# Altium schematic sheet USB_SWITCH.SchDoc
size A3; SheetNumber: 13; SheetTotal: 23
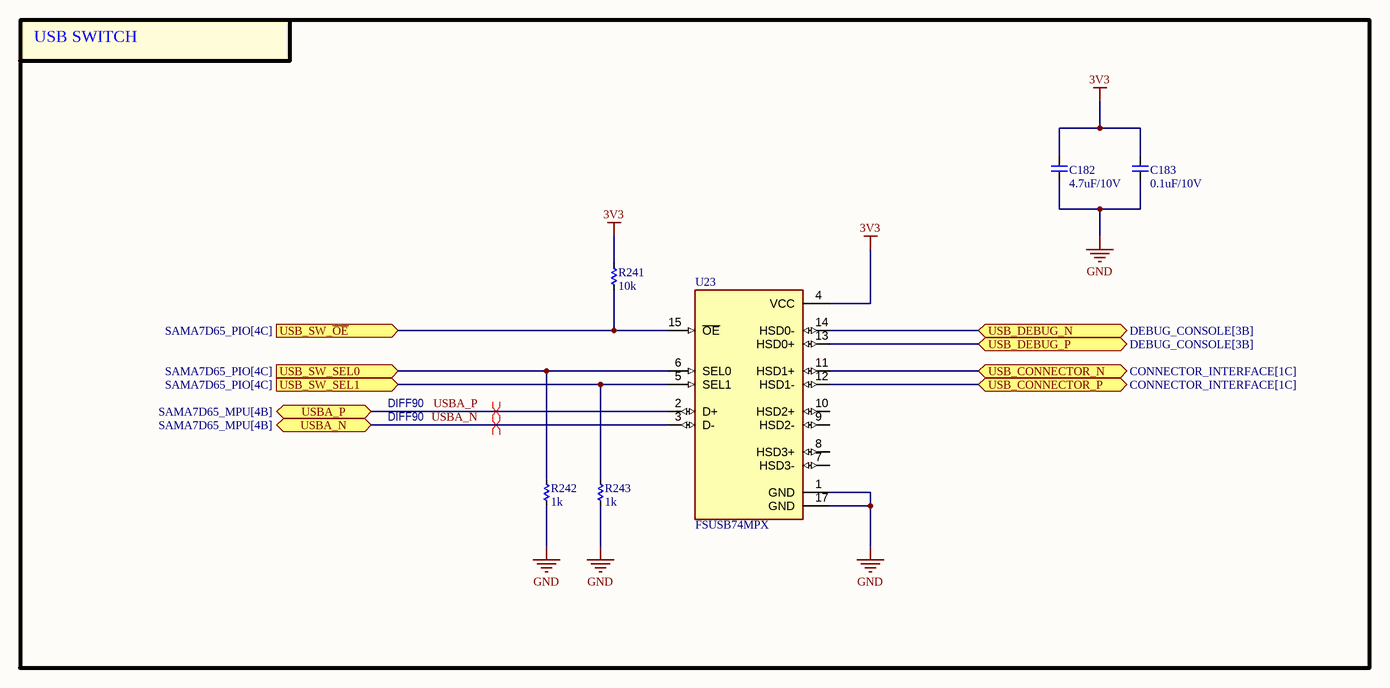
[diagram p0: USB_SWITCH.SchDoc]

## Parts
C182  4.7uF/10V  [CAP_C_1005X50_L]
C183  0.1uF/10V  [CAP_C_1005X50_L]
R241  10k  [RES_C_1005X40]
R242  1k  [RES_C_1005X40]
R243  1k  [RES_C_1005X40]
U23  FSUSB74MPX  [QFN50P300X300X80-17N]

## Blocks framed on the sheet
USB SWITCH: C182 C183 R241-R243 U23

## Ports
USB_CONNECTOR_N (bidir, see CONNECTOR_INTERFACE[1C]), USB_CONNECTOR_P (bidir, see CONNECTOR_INTERFACE[1C]), USB_DEBUG_N (bidir, see DEBUG_CONSOLE[3B]), USB_DEBUG_P (bidir, see DEBUG_CONSOLE[3B]), USB_SW_SEL0 (in, see SAMA7D65_PIO[4C]), USB_SW_SEL1 (in, see SAMA7D65_PIO[4C]), USB_SW_~{OE} (in, see SAMA7D65_PIO[4C]), USBA_N (bidir, see SAMA7D65_MPU[4B]), USBA_P (bidir, see SAMA7D65_MPU[4B])

## Nets
3V3: C182.2 C183.2 R241.2 U23.4(VCC)
GND: C182.1 C183.1 R242.1 R243.1 U23.1(GND) U23.17(GND)
USB_CONNECTOR_N: U23.11(HSD1+) ; port USB_CONNECTOR_N
USB_CONNECTOR_P: U23.12(HSD1-) ; port USB_CONNECTOR_P
USB_DEBUG_N: U23.14(HSD0-) ; port USB_DEBUG_N
USB_DEBUG_P: U23.13(HSD0+) ; port USB_DEBUG_P
USB_SW_~{OE}: R241.1 U23.15(~{OE}) ; port USB_SW_~{OE}
USB_SW_SEL0: R242.2 U23.6(SEL0) ; port USB_SW_SEL0
USB_SW_SEL1: R243.2 U23.5(SEL1) ; port USB_SW_SEL1
USBA_N: U23.3(D-) ; port USBA_N
USBA_P: U23.2(D+) ; port USBA_P

Not connected (* = marked no-connect by the designer): U23 7(HSD3-) 8(HSD3+) 9(HSD2-) 10(HSD2+)

## Layout directives
differential pair; differential pair class DIFF90; net class DIFF90; rule Matched Net Lengths [Tolerance = 4mil]: USBA_N, USBA_P

## Notes on the sheet
- Project:
- Page Contents:
- Revision:
- Design:
- Date:
- Size:
- A3
- Document Number:
- Sheet:
- of

## Library data of the parts
C182 C183 = _CAP_C_2: CAP CHIP
R241-R243 = _RES_B_2: RES
U23 = IC_USB_SW_FSUSB74MPX: USB Switch IC 1 Channel 16-MLP (3x3); MF: ON Semiconductor; SnapEDA_Link: https://www.snapeda.com/parts/FSUSB74MPX/Onsemi/view-part/?ref=snap; Package: WQFN-16 ON Semiconductor; Value: *; MP: FSUSB74MPX; Check_prices: https://www.snapeda.com/parts/FSUSB74MPX/Onsemi/view-part/?ref=eda